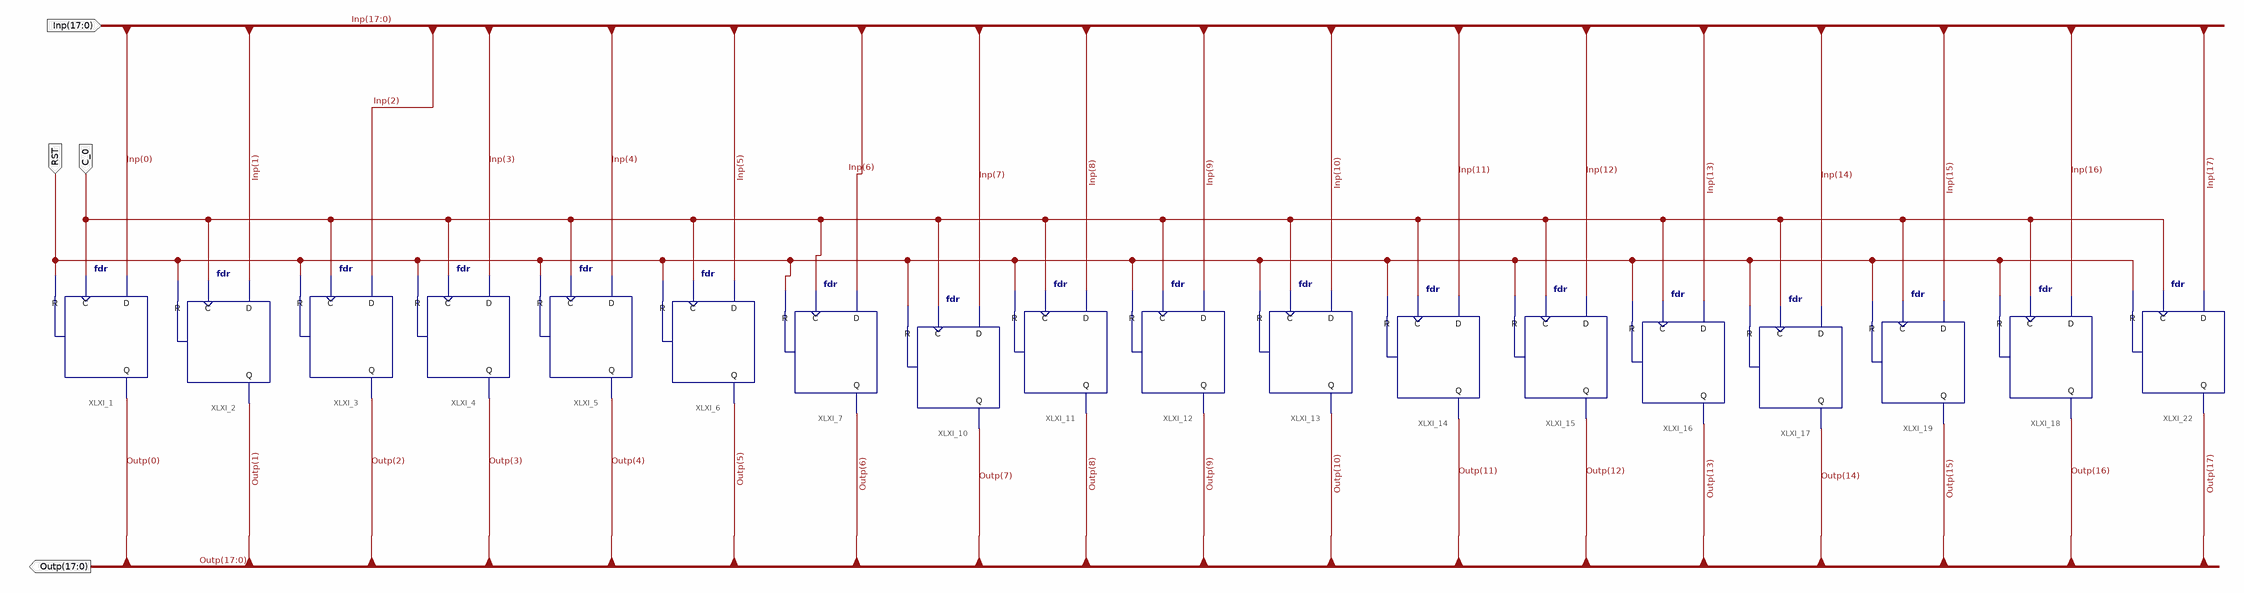
[diagram p0: schematic sheet 1]
// Xilinx ISE schematic Flip_Flop_18.sch (spartan3e) as structural Verilog: 18 symbols, 4 ports
module Flip_Flop_18 (
  input  C_0,
  input  RST,
  input  [17:0] Inp,
  output [17:0] Outp
);

  fdr XLXI_1 (.C(C_0), .D(Inp[0]), .R(RST), .Q(Outp[0]));
  fdr XLXI_2 (.C(C_0), .D(Inp[1]), .R(RST), .Q(Outp[1]));
  fdr XLXI_3 (.C(C_0), .D(Inp[2]), .R(RST), .Q(Outp[2]));
  fdr XLXI_4 (.C(C_0), .D(Inp[3]), .R(RST), .Q(Outp[3]));
  fdr XLXI_5 (.C(C_0), .D(Inp[4]), .R(RST), .Q(Outp[4]));
  fdr XLXI_6 (.C(C_0), .D(Inp[5]), .R(RST), .Q(Outp[5]));
  fdr XLXI_7 (.C(C_0), .D(Inp[6]), .R(RST), .Q(Outp[6]));
  fdr XLXI_10 (.C(C_0), .D(Inp[7]), .R(RST), .Q(Outp[7]));
  fdr XLXI_11 (.C(C_0), .D(Inp[8]), .R(RST), .Q(Outp[8]));
  fdr XLXI_14 (.C(C_0), .D(Inp[11]), .R(RST), .Q(Outp[11]));
  fdr XLXI_15 (.C(C_0), .D(Inp[12]), .R(RST), .Q(Outp[12]));
  fdr XLXI_16 (.C(C_0), .D(Inp[13]), .R(RST), .Q(Outp[13]));
  fdr XLXI_17 (.C(C_0), .D(Inp[14]), .R(RST), .Q(Outp[14]));
  fdr XLXI_18 (.C(C_0), .D(Inp[16]), .R(RST), .Q(Outp[16]));
  fdr XLXI_19 (.C(C_0), .D(Inp[15]), .R(RST), .Q(Outp[15]));
  fdr XLXI_12 (.C(C_0), .D(Inp[9]), .R(RST), .Q(Outp[9]));
  fdr XLXI_13 (.C(C_0), .D(Inp[10]), .R(RST), .Q(Outp[10]));
  fdr XLXI_22 (.C(C_0), .D(Inp[17]), .R(RST), .Q(Outp[17]));
endmodule
